# Altium project udemy_osman.PrjPcb (part 2 of 2)

## Sheet sensor board.SchDoc
size A3; SheetNumber: 5; SheetTotal: 5; department: R&D; Size: A3
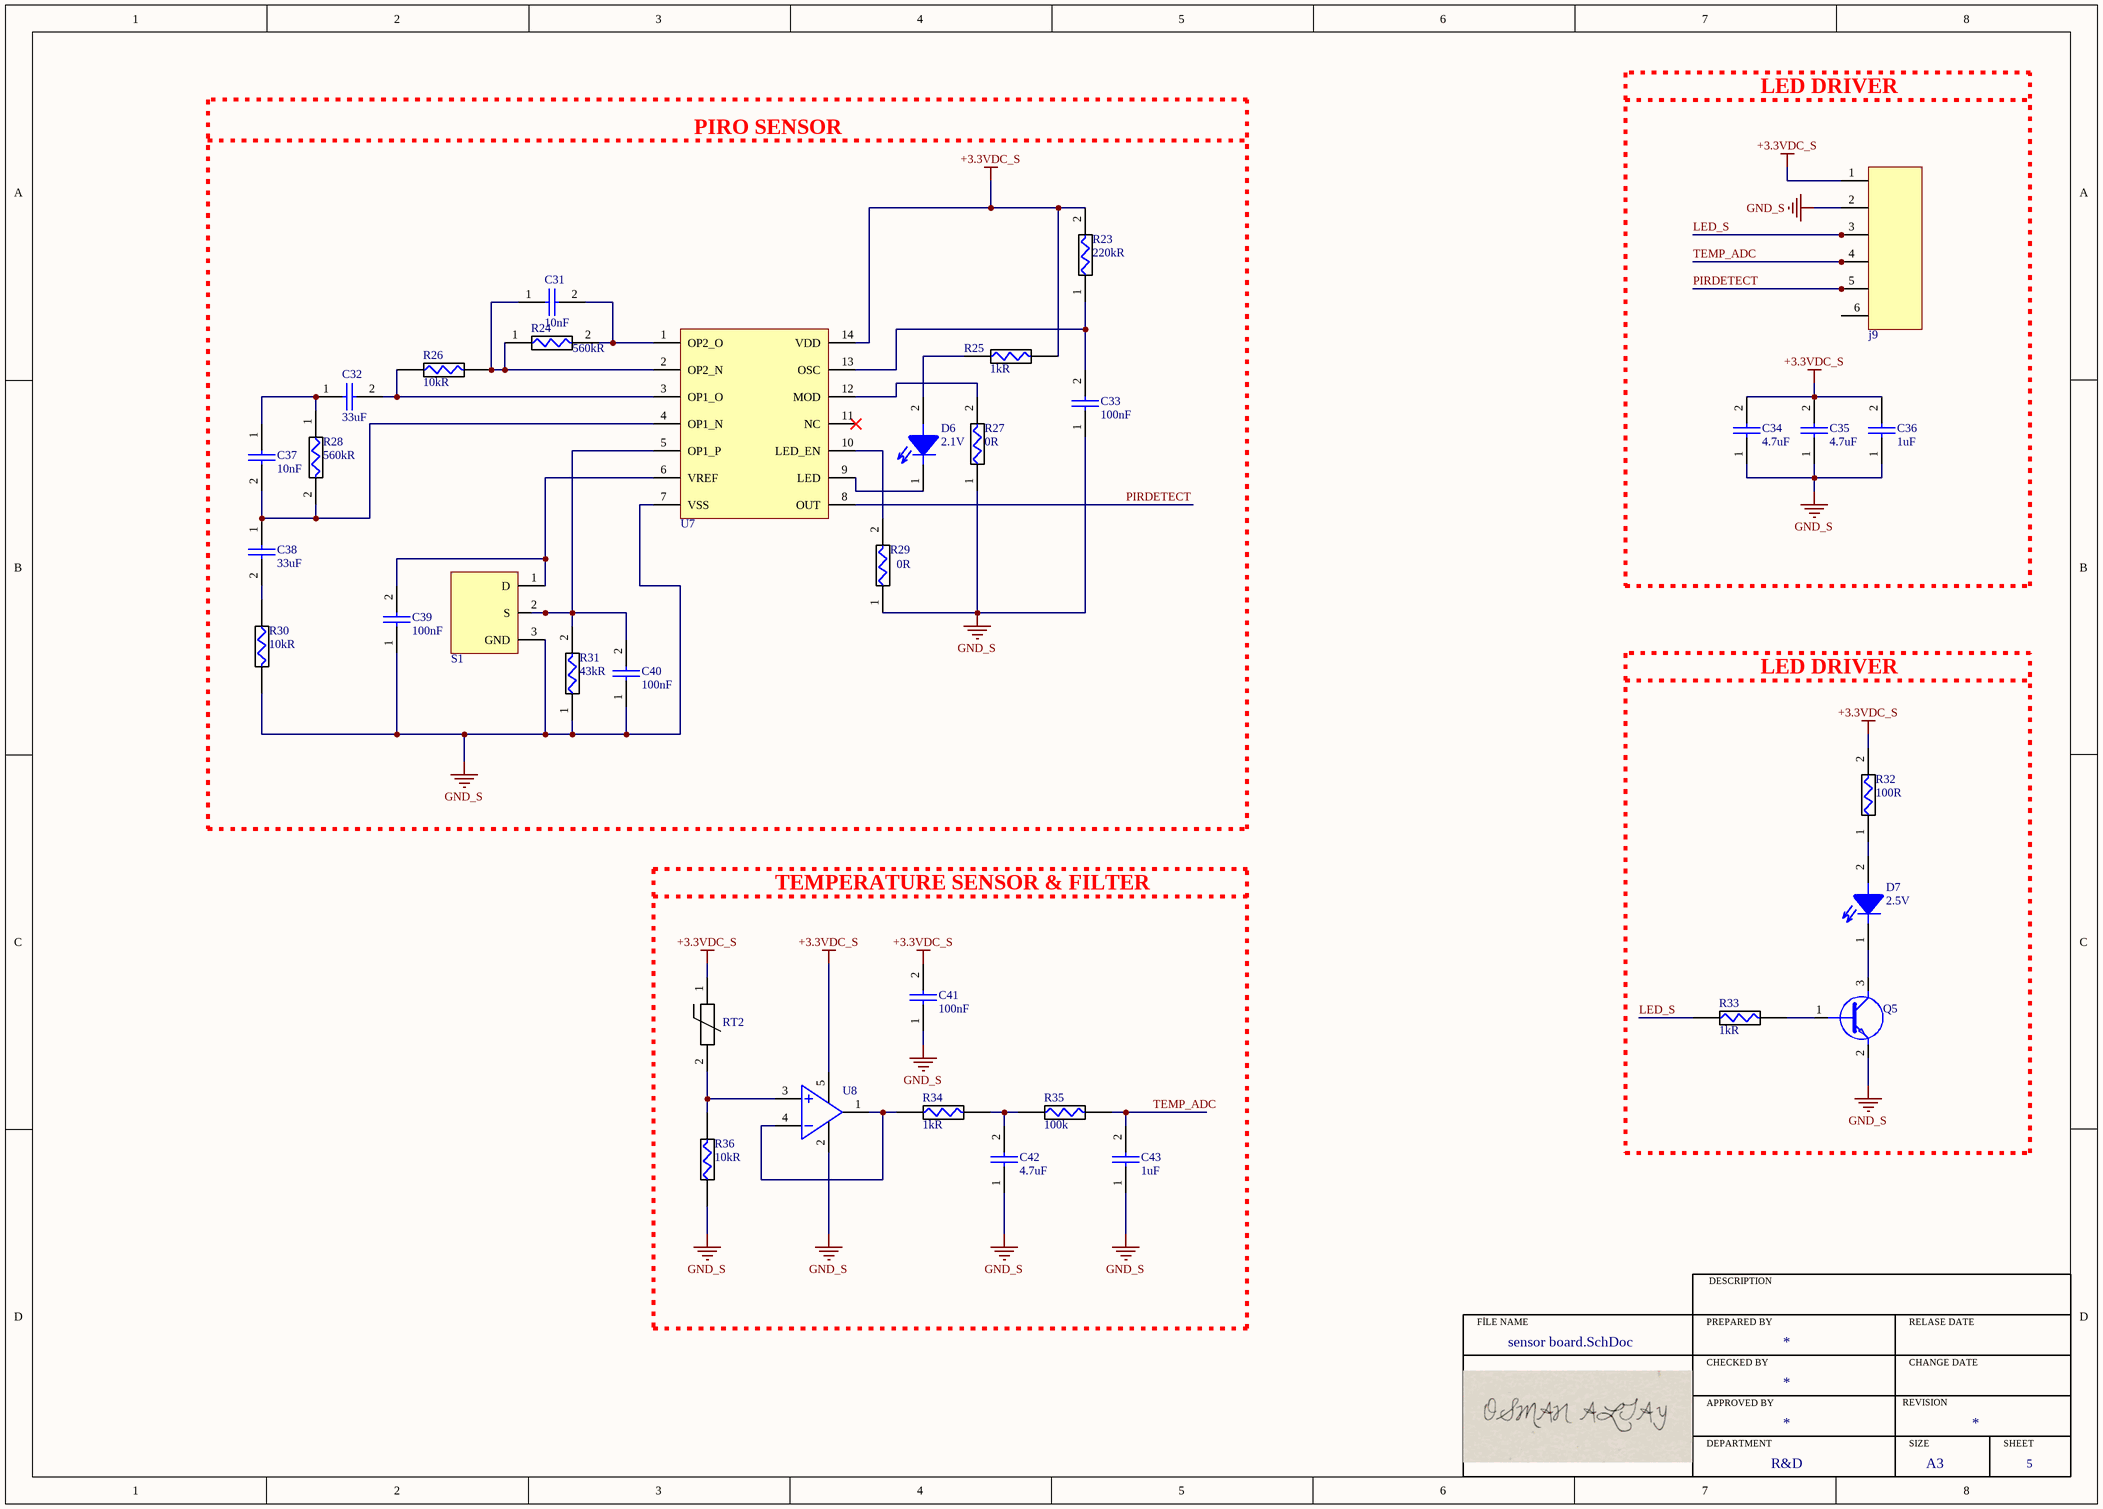
[diagram p2: sensor board.SchDoc]

### Parts
C31  value 10nF  [CAP_0603]  (hidden comment: 0603B103K160CT)
C32  value 33uF  [CAP_1206]  (hidden comment: C3216X5R1E336M160AC)
C33  value 100nF  [CAP_0603]  (hidden comment: C0603C104K1RACTU)
C34  value 4.7uF  [CAP_0805]  (hidden comment: CL21A475KAQNNNE)
C35  value 4.7uF  [CAP_0805]  (hidden comment: CL21A475KAQNNNE)
C36  value 1uF  [CAP_0805]  (hidden comment: CL21B105KBFNNNE)
C37  value 10nF  [CAP_0603]  (hidden comment: 0603B103K160CT)
C38  value 33uF  [CAP_1206]  (hidden comment: C3216X5R1E336M160AC)
C39  value 100nF  [CAP_0603]  (hidden comment: C0603C104K1RACTU)
C40  value 100nF  [CAP_0603]  (hidden comment: C0603C104K1RACTU)
C41  value 100nF  [CAP_0805]  (hidden comment: CL21B104KBCNNNC)
C42  value 4.7uF  [CAP_0805]  (hidden comment: CL21A475KAQNNNE)
C43  value 1uF  [CAP_0805]  (hidden comment: CL21B105KBFNNNE)
D6  foward voltage: 2.1V  [LED_GREEN_0805]  (hidden comment: CMD17-21VGD/TR8)
D7  Forward Voltage: 2.5V  [LED_RED_0805]  (hidden comment: LS R976-NR-1)
j9  64800611622  [64800611622_]  (value not drawn)
Q5  MMBT3904-7-F  [SOT23-3]  (value not drawn)
R23  value 220kR  [RES_0603]  (hidden comment: RC0201JR-07220KL)
R24  value 560kR  [RES_0603]  (hidden comment: RC0603JR-07560KL)
R25  value 1kR  [RES_0603]  (hidden comment: RC0201JR-071KL)
R26  value 10kR  [RES_0603]  (hidden comment: RC0603FR-0710KL)
R27  value 0R  [RES_0603]  (hidden comment: RC0603JR-070RL)
R28  value 560kR  [RES_0603]  (hidden comment: RC0603JR-07560KL)
R29  value 0R  [RES_0603]  (hidden comment: RC0603JR-070RL)
R30  value 10kR  [RES_0603]  (hidden comment: RC0603FR-0710KL)
R31  value 43kR  [RES_0603]  (hidden comment: RC0201JR-0743KL)
R32  value 100R  [RES_0603]  (hidden comment: RC0603FR-07100RL)
R33  value 1kR  [RES_0603]  (hidden comment: RC0201JR-071KL)
R34  value 1kR  [RES_0603]  (hidden comment: RC0201JR-071KL)
R35  value 100k  [RES_0603]  (hidden comment: SR0603FR-7T100KL)
R36  value 10kR  [RES_0603]  (hidden comment: RC0603FR-0710KL)
RT2  TFPT1206L1002FM  [TFPT1206]  (value not drawn)
S1  LHI 878/3902  [LHI 878]  (value not drawn)
U7  NCS36000DRG  [SOIC-14]  (value not drawn)
U8  OPA314AIDBVR  [SOT23-5]  (value not drawn)

### Blocks framed on the sheet
PIRO SENSOR: C31-C33 C37-C40 D6 R23-R31 S1 U7
LED DRIVER: C34-C36 j9
LED DRIVER: D7 Q5 R32 R33
TEMPERATURE SENSOR & FILTER: C41-C43 R34-R36 RT2 U8

### Nets
+3.3VDC_S: C34.2 C35.2 C36.2 C41.2 j9.1 R23.2 R25.2 R32.2 RT2.1 U7.14(VDD) U8.5(V+)
GND_S: C33.1 C34.1 C35.1 C36.1 C39.1 C40.1 C41.1 C42.1 C43.1 j9.2 Q5.2(E) R27.1 R29.1 R30.2 R31.1 R36.1 S1.3(GND) U7.7(VSS) U8.2(V-)
LED_S: j9.3 R33.1
PIRDETECT: j9.5 U7.8(OUT)
TEMP_ADC: C43.2 j9.4 R35.2
NetC31_1: C31.1 R24.1 R26.2 U7.2(OP2_N)
NetC31_2: C31.2 R24.2 U7.1(OP2_O)
NetC32_1: C32.1 C37.1 R28.1
NetC32_2: C32.2 R26.1 U7.3(OP1_O)
NetC33_2: C33.2 R23.1 U7.13(OSC)
NetC37_2: C37.2 C38.1 R28.2 U7.4(OP1_N)
NetC38_2: C38.2 R30.1
NetC39_2: C39.2 S1.1(D) U7.6(VREF)
NetC40_2: C40.2 R31.2 S1.2(S) U7.5(OP1_P)
NetC42_2: C42.2 R34.2 R35.1
NetD6_1: D6.1 U7.9(LED)
NetD6_2: D6.2 R25.1
NetD7_1: D7.1 Q5.3(C)
NetD7_2: D7.2 R32.1
NetQ5_1: Q5.1(B) R33.2
NetR27_2: R27.2 U7.12(MOD)
NetR29_2: R29.2 U7.10(LED_EN)
NetR34_1: R34.1 U8.1(OUT) U8.4(-IN)
NetR36_2: R36.2 RT2.2 U8.3(+IN)

Not connected (* = marked no-connect by the designer): j9 6; U7 11(NC)*

### Notes on the sheet
- FİLE NAME
- PREPARED BY
- DESCRIPTION
- RELASE DATE
- CHECKED BY
- APPROVED BY
- CHANGE DATE
- DEPARTMENT
- SIZE
- REVISION
- SHEET

### Library data of the parts
C31 C37 = CAP CER 10nF 0603: CAP CER 10nF %10 0603; Manufacturer: Walsin Technologies; Designed By: Osman; Supplier: Mouser; Supplier Part Number: 791-0603B103K160CT; Manufacturer Part Number: 0603B103K160CT; RoHS: Yes; Category: Ceramic Capacitors; Stock: 10639; Pricing: 1=0,1, 10=0,019, 50=0,019, 100=0,011, 1000=0,009, 10000=0,006 (USD); Lead Free: 5697LeadFree; ComponentLink1URL: http://www.farnell.com/datasheets/1958513.pdf?src-supplier=Farnell; ComponentLink1Description: http://www.farnell.com/datasheets/1958513.pdf?src-supplier=Farnell; ComponentLink2URL: http://www.passivecomponent.com/wp-content/uploads/2018/10/MLCC.pdf?src-supplier=Digi-Key; ComponentLink2Description: http://www.passivecomponent.com/wp-content/uploads/2018/10/MLCC.pdf?src-supplier=Digi-Key; ComponentLink3URL: https://datasheet.octopart.com/0603B103K160CT-Walsin-Technologies-datasheet-85392065.pdf?src-supplier=Element14; ComponentLink3Description: https://datasheet.octopart.com/0603B103K160CT-Walsin-Technologies-datasheet-85392065.pdf?src-supplier=Element14; ComponentLink4URL: https://datasheet.octopart.com/0603B103K160CT-Walsin-Technologies-datasheet-136037192.pdf?src-supplier=Future+Electronics; ComponentLink4Description: https://datasheet.octopart.com/0603B103K160CT-Walsin-Technologies-datasheet-136037192.pdf?src-supplier=Future+Electronics; ComponentLink5URL: https://datasheet.octopart.com/0603B103K160CT-Walsin-Technologies-datasheet-62066062.pdf?src-supplier=TME; ComponentLink5Description: https://datasheet.octopart.com/0603B103K160CT-Walsin-Technologies-datasheet-62066062.pdf?src-supplier=TME
C32 C38 = CAP CER 33uF 0603: Multilayer Ceramic Capacitor, 33 uF, 25 V, ± 20%, X5R, 1206 [3216 Metric]; Manufacturer: TDK; Material: 4241ConductorMaterial; ComponentLink1URL: https://datasheet.ciiva.com/24216/c3216x5r1e336m160ac-265051-24216512.pdf?src-supplier=Mouser; ComponentLink1Description: https://datasheet.ciiva.com/24216/c3216x5r1e336m160ac-265051-24216512.pdf?src-supplier=Mouser; ComponentLink2URL: https://datasheet.ciiva.com/6285/tdkmlcccaprange-6285278.pdf?src-supplier=Digi-Key; ComponentLink2Description: https://datasheet.ciiva.com/6285/tdkmlcccaprange-6285278.pdf?src-supplier=Digi-Key; Supplier: Digi-Key; Supplier Part Number: 445-8046-6-ND; Manufacturer Part Number: C3216X5R1E336M160AC; RoHS: Yes; Category: Ceramic Capacitors; Stock: 212727; Pricing: 1=0,93, 10=0,698, 50=0,637, 100=0,5218, 500=0,4165, 1000=0,3675 (USD)
C33 C39 C40 = CAP CER 100nf 0603: Capacitor, 0.1UF, 100V, MLCC, 0603;; Manufacturer: KEMET; Designed By: Osman; Supplier: Digi-Key; Supplier Part Number: 399-C0603C104K1RACTUCT-ND; Manufacturer Part Number: C0603C104K1RACTU; RoHS: No; Category: Ceramic Capacitors; Stock: 5862; Pricing: 1=0,27, 10=0,185, 50=0,1232, 100=0,1048, 500=0,07396, 1000=0,06471 (USD)
C34 C35 C42 = CAP CER 4.7uF 0805: CAP CER 4.7uF %10 0805; Manufacturer: Samsung; Material: Ceramic; Tolerance: 10%; Voltage Rating: 25V; Dielectric: X5R; Supplier Part Number: 187-CL21A475KAQNNNE; Manufacturer Part Number: CL21A475KAQNNNE; RoHS: Yes; Category: Ceramic Capacitors; Stock: 195468; Pricing: 1=0,1, 10=0,059, 50=0,059, 100=0,035, 1000=0,025, 10000=0,012 (USD); Mounting Technology: Surface Mount; Case/Package: 0805; Case Code (Metric): 2012; Case Code (Imperial): 0805; Min Operating Temperature: -55°C; Max Operating Temperature: 85°C; Packaging: Tape and Reel; Voltage Rating (DC): 25V; Series: CL; Construction: Flat; Length: 2mm; Height: 1.25mm; Depth: 1.25mm; Radiation Hardening: No; Lead Free: Lead Free; RoHS Compliant: Yes; ComponentLink1URL: https://datasheet.ciiva.com/25798/cl21a475kaqnnne-25798882.pdf?src-supplier=Digi-Key; ComponentLink1Description: https://datasheet.ciiva.com/25798/cl21a475kaqnnne-25798882.pdf?src-supplier=Digi-Key; Supplier: Mouser
C36 C43 = CAP CER 1uF 0805: CAP CER 1uF %10 0805; Manufacturer: Samsung; Material: Ceramic; Tolerance: 10%; Voltage Rating: 50V; Dielectric: X7R; Designed By: Osman; Supplier: Mouser; Supplier Part Number: 187-CL21B105KBFNNNE; Manufacturer Part Number: CL21B105KBFNNNE; RoHS: Yes; Category: Ceramic Capacitors; Stock: 126210; Pricing: 1=0,11, 10=0,045, 50=0,045, 100=0,027, 1000=0,026, 10000=0,015 (USD); Mounting Technology: Surface Mount; Case/Package: 0805; Case Code (Metric): 2012; Case Code (Imperial): 0805; Min Operating Temperature: -55°C; Max Operating Temperature: 125°C; Packaging: Tape and Reel; Package Quantity: 1; Voltage: 50V; Series: CL; Construction: Flat; Voltage Rating (DC): 50V; Length: 2mm; Width: 0.049inch; Height: 1.25mm; Thickness: 0.053inch; Depth: 1.25mm; Radiation Hardening: No; RoHS Compliant: Yes; ComponentLink1URL: https://datasheet.ciiva.com/25800/cl21b105kbfnnne-25800291.pdf?src-supplier=Digi-Key; ComponentLink1Description: https://datasheet.ciiva.com/25800/cl21b105kbfnnne-25800291.pdf?src-supplier=Digi-Key
C41 = CAP CER 100nF 0805: Manufacturer: Samsung; Material: Ceramic; Tolerance: 10%; Dielectric: X7R; Voltage Rating: 50V; Designed By: OSMAN; Supplier: Mouser; Supplier Part Number: 187-CL21B104KBCNNNC; Manufacturer Part Number: CL21B104KBCNNNC; RoHS: Yes; Category: Ceramic Capacitors; Stock: 995893; Pricing: 1=0,1, 10=0,024, 50=0,024, 100=0,014, 1000=0,012, 10000=0,008 (USD); Mounting Technology: Surface Mount; Case/Package: 0805; Case Code (Metric): 2012; Case Code (Imperial): 0805; Min Operating Temperature: -55°C; Max Operating Temperature: 125°C; Packaging: Tape and Reel; Voltage: 50V; Series: CL; Construction: Flat; Voltage Rating (DC): 50V; Length: 2mm; Width: 0.049inch; Height: 0.85mm; Depth: 1.25mm; Thickness: 0.037inch; Radiation Hardening: No; RoHS Compliant: Yes; Lead Free: 5697LeadFree; ComponentLink1URL: https://datasheet.ciiva.com/25710/cl21b104kbcnnnc-25710182.pdf?src-supplier=Digi-Key; ComponentLink1Description: https://datasheet.ciiva.com/25710/cl21b104kbcnnnc-25710182.pdf?src-supplier=Digi-Key; ComponentLink2URL: https://datasheet.ciiva.com/29199/454152-da-01-en-vs-kondensator-0805-29199814.pdf?src-supplier=Conrad; ComponentLink2Description: https://datasheet.ciiva.com/29199/454152-da-01-en-vs-kondensator-0805-29199814.pdf?src-supplier=Conrad
D6 = LED GREEN 0805: CML CMD17-21VGD/TR8 LED SMT 0805 2.1V 7mcd 140deg Green 3K Part of the VCC Family of Products; Manufacturer: VCC CHML; Supplier: Mouser; Supplier Part Number: 606-CMD17-21VGD; Manufacturer Part Number: CMD17-21VGD/TR8; RoHS: Yes; Category: LEDs; Stock: 23475; Pricing: 1=0,55, 10=0,358, 50=0,358, 100=0,257, 1000=0,208, 10000=0,189 (USD); ComponentLink1URL: https://datasheet.ciiva.com/46391/719069-46391062.pdf?src-supplier=Element14; ComponentLink1Description: https://datasheet.ciiva.com/46391/719069-46391062.pdf?src-supplier=Element14; ComponentLink2URL: https://datasheet.ciiva.com/16437/cmd17-21seriessmtleds0805packagesize-16437018.pdf?src-supplier=Future+Electronics; ComponentLink2Description: https://datasheet.ciiva.com/16437/cmd17-21seriessmtleds0805packagesize-16437018.pdf?src-supplier=Future+Electronics
D7 = LED RED 0805: LED Uni-Color Super Red 645nm 2-Pin Chip 0805(2012Metric) T/R; Manufacturer: Osram Opto; Designed By: Osman; Lens Color: White; Viewing Angle: 160°; Lens Style: Flat,Diffused,Colorless,Rectangular; Dominant Wavelength: 633nm; Luminous Flux: 0.47lm; Number of LEDs: 1; Forward Current: 25mA; Luminous Intensity: 180mcd; Test Current: 20mA; Power Dissipation: 65mW; Reverse Voltage: 12V; Lens Transparency: Diffused; Lens Size: 1.25mm; Supplier: Mouser; Supplier Part Number: 720-LSR976-NR-1; Manufacturer Part Number: LSR976-NR-1; RoHS: Yes; Category: LEDs; Stock: 694789; Pricing: 1=0,27, 10=0,147, 50=0,147, 100=0,063, 1000=0,05, 10000=0,038 (USD); Mounting Technology: Surface Mount; Case/Package: 0805; Pins: 2; Color: Red; Case Code (Metric): 2012; Case Code (Imperial): 0805; Min Operating Temperature: -30°C; Max Operating Temperature: 85°C; Packaging: Tape and Reel; Illumination Color: Red; Package Quantity: 16000; Number of Elements: 1; Series: CHIPLED 0805; Wavelength: 633nm; Length: 2.1mm; Width: 1.25mm; Height: 0.9mm; Depth: 1.35mm; Radiation Hardening: No; RoHS Compliant: Yes; ComponentLink1URL: https://datasheet.ciiva.com/4688/o-ls-ly-r976-24152-4688435.pdf?src-supplier=Mouser; ComponentLink1Description: https://datasheet.ciiva.com/4688/o-ls-ly-r976-24152-4688435.pdf?src-supplier=Mouser; ComponentLink2URL: https://datasheet.ciiva.com/26920/getdatasheetpartid-568367-26920831.pdf?src-supplier=Verical; ComponentLink2Description: https://datasheet.ciiva.com/26920/getdatasheetpartid-568367-26920831.pdf?src-supplier=Verical; ComponentLink3URL: https://datasheet.ciiva.com/2112/00078896-0-2112782.pdf?src-supplier=Digi-Key; ComponentLink3Description: https://datasheet.ciiva.com/2112/00078896-0-2112782.pdf?src-supplier=Digi-Key; ComponentLink4URL: https://datasheet.ciiva.com/2112/00078896-0-2112781.pdf?src-supplier=Digi-Key; ComponentLink4Description: https://datasheet.ciiva.com/2112/00078896-0-2112781.pdf?src-supplier=Digi-Key; ComponentLink5URL: https://datasheet.ciiva.com/2112/00078896-0-2112783.pdf?src-supplier=Digi-Key; ComponentLink5Description: https://datasheet.ciiva.com/2112/00078896-0-2112783.pdf?src-supplier=Digi-Key
j9 = 64800611622_conn_6pin: WR-WTB Wire-to-Board Connectors 1.50 mm; Manufacturer: Wurth Electronics; Supplier: Farnell; Supplier Part Number: 3818179; Manufacturer Part Number: 64800611622; RoHS: No; Category: Uncategorized; Stock: 8; Pricing: 10=0,407, 100=0,343, 500=0,307, 1000=0,284, 2500=0,275, 5000=0,257 (EUR)
Q5 = MMBT3904-7-F: Transistor General Purpose BJT NPN 40 Volt 0.2A Automotive 3-Pin SOT-23; Manufacturer: Diodes Zetex; Designed By: Osman; Max Power Dissipation: 300mW; Collector Emitter Voltage (VCEO): 40V; Max Collector Current: 200mA; Collector Base Voltage (VCBO): 60V; Power Dissipation: 350mW; Frequency: 300MHz; hFE Min: 100; Number of Elements: 1; Emitter Base Voltage (VEBO): 6V; Collector Emitter Saturation Voltage: 300mV; Supplier: Mouser; Supplier Part Number: 621-MMBT3904-F; Manufacturer Part Number: MMBT3904-7-F; RoHS: Yes; Category: BJTs; Stock: 3104650; Pricing: 1=0,11, 10=0,076, 50=0,076, 100=0,048, 1000=0,021, 10000=0,014 (USD); Mounting Technology: Surface Mount; Case/Package: SOT-23; Pins: 3; Weight: 0.000282oz; Min Operating Temperature: -55°C; Max Operating Temperature: 150°C; Polarity: NPN; Packaging: Tape and Reel; Package Quantity: 3000; Transition Frequency: 300MHz; Collector Emitter Breakdown Voltage: 40V; Max Breakdown Voltage: 40V; Continuous Collector Current: 200mA; Clock Frequency: 300MHz; Gain Bandwidth Product: 300MHz; Voltage Rating (DC): 40V; Series: Automotive, AEC-Q101; Collector-emitter Voltage-Max: 300mV; Length: 3.05mm; Width: 1.4mm; Height: 1mm; Radiation Hardening: No; Reach SVHC Compliant: No; Lead Free: Lead Free; RoHS Compliant: Yes; ComponentLink1URL: https://datasheet.ciiva.com/11201/ds30036-11201778.pdf?src-supplier=Avnet; ComponentLink1Description: https://datasheet.ciiva.com/11201/ds30036-11201778.pdf?src-supplier=Avnet; ComponentLink2URL: https://datasheet.ciiva.com/15138/getdatasheetpartid-53265-15138780.pdf?src-supplier=Verical; ComponentLink2Description: https://datasheet.ciiva.com/15138/getdatasheetpartid-53265-15138780.pdf?src-supplier=Verical; ComponentLink3URL: https://datasheet.ciiva.com/22711/1915516-22711750.pdf?src-supplier=Element14; ComponentLink3Description: https://datasheet.ciiva.com/22711/1915516-22711750.pdf?src-supplier=Element14; ComponentLink4URL: https://datasheet.ciiva.com/11198/ds30036-11198999.pdf?src-supplier=Avnet; ComponentLink4Description: https://datasheet.ciiva.com/11198/ds30036-11198999.pdf?src-supplier=Avnet; ComponentLink5URL: https://datasheet.ciiva.com/6361/ds30036-6361256.pdf?src-supplier=Digi-Key; ComponentLink5Description: https://datasheet.ciiva.com/6361/ds30036-6361256.pdf?src-supplier=Digi-Key; ComponentLink6URL: https://datasheet.ciiva.com/6361/ds30036-6361254.pdf?src-supplier=Digi-Key; ComponentLink6Description: https://datasheet.ciiva.com/6361/ds30036-6361254.pdf?src-supplier=Digi-Key
R23 = RES 220K OHM 0603: SMD Chip Resistor, 220 kOhm, ± 5%, 50 mW, 0201 [0603 Metric], Thick Film, General Purpose; Manufacturer: Yageo; Voltage Rating (DC): 25V; Supplier: Digi-Key; Supplier Part Number: 311-220KNTR-ND; Manufacturer Part Number: RC0201JR-07220KL; RoHS: Yes; Category: Chip SMD Resistors; Stock: 10000; Pricing: 10000=0,00414, 20000=0,0037, 30000=0,00347, 50000=0,00322, 100000=0,00293 (USD); ComponentLink1URL: https://datasheet.ciiva.com/2522/pyu-r-int-thick-7-2522686.pdf?src-supplier=Digi-Key; ComponentLink1Description: https://datasheet.ciiva.com/2522/pyu-r-int-thick-7-2522686.pdf?src-supplier=Digi-Key; ComponentLink2URL: https://datasheet.ciiva.com/2522/pyu-r-int-thick-7-2522687.pdf?src-supplier=Digi-Key; ComponentLink2Description: https://datasheet.ciiva.com/2522/pyu-r-int-thick-7-2522687.pdf?src-supplier=Digi-Key; ComponentLink3URL: https://datasheet.ciiva.com/2522/pyu-r-int-thick-7-2522688.pdf?src-supplier=Digi-Key; ComponentLink3Description: https://datasheet.ciiva.com/2522/pyu-r-int-thick-7-2522688.pdf?src-supplier=Digi-Key; ComponentLink4URL: https://datasheet.ciiva.com/5924/1563626-5924922.pdf?src-supplier=Farnell; ComponentLink4Description: https://datasheet.ciiva.com/5924/1563626-5924922.pdf?src-supplier=Farnell; ComponentLink5URL: https://datasheet.ciiva.com/8886/pyu-rc0201-51-rohs-l-8-8886799.pdf?src-supplier=Avnet; ComponentLink5Description: https://datasheet.ciiva.com/8886/pyu-rc0201-51-rohs-l-8-8886799.pdf?src-supplier=Avnet; ComponentLink6URL: https://datasheet.ciiva.com/7672/1563626-7672268.pdf?src-supplier=Element14; ComponentLink6Description: https://datasheet.ciiva.com/7672/1563626-7672268.pdf?src-supplier=Element14; ComponentLink7URL: https://datasheet.ciiva.com/7672/1563626-7672269.pdf?src-supplier=Element14; ComponentLink7Description: https://datasheet.ciiva.com/7672/1563626-7672269.pdf?src-supplier=Element14
R24 R28 = RES 560K OHM 0603: SMD Chip Resistor, 560 kOhm, ± 5%, 100 mW, 0603 [1608 Metric], Thick Film, General Purpose; Manufacturer: Yageo; Designed By: OSMAN; Power Rating: 100mW; Voltage Rating: 75V; Voltage Rating (DC): 50V; Temperature Coefficient: 100ppm/°C; Supplier: Farnell; Supplier Part Number: 4151651; Manufacturer Part Number: RC0603JR-07560KL; RoHS: Yes; Category: Chip SMD Resistors; Stock: 5000; Pricing: 5000=0,003, 25000=0,0025, 50000=0,002 (EUR); Case/Package: 0603; Pins: 2; Case Code (Metric): 1608; Case Code (Imperial): 0603; Weight: 7.1E-05oz; Min Operating Temperature: -55°C; Max Operating Temperature: 155°C; Package Quantity: 1; Tolerance: 5%; Packaging: Tape and Reel; Resistor Type: Thick Film; Number of Terminations: 2; Termination: SMD/SMT; Max Power Dissipation: 100mW; Working Voltage: 75V; Features: Moisture Resistant; Series: RC; Resistance Tolerance: 5%; Technology: THICK FILM; Voltage Rating (AC): 50V; Length: 0.063inch; Width: 0.8mm; Height: 0.022inch; Lead Free: Lead Free; RoHS Compliant: Yes; Reach SVHC Compliant: Unknown; ComponentLink1URL: https://datasheet.ciiva.com/2453/pyu-r-int-thick-7-2453056.pdf?src-supplier=Digi-Key; ComponentLink1Description: https://datasheet.ciiva.com/2453/pyu-r-int-thick-7-2453056.pdf?src-supplier=Digi-Key; ComponentLink2URL: https://datasheet.ciiva.com/2453/pyu-r-int-thick-7-2453057.pdf?src-supplier=Digi-Key; ComponentLink2Description: https://datasheet.ciiva.com/2453/pyu-r-int-thick-7-2453057.pdf?src-supplier=Digi-Key; ComponentLink3URL: https://datasheet.ciiva.com/2453/pyu-r-int-thick-7-2453055.pdf?src-supplier=Digi-Key; ComponentLink3Description: https://datasheet.ciiva.com/2453/pyu-r-int-thick-7-2453055.pdf?src-supplier=Digi-Key
R25 R33 R34 = RES 1K OHM 0603: Res Thick Film 0201 1K Ohm 5% 0.05W(1/20W) ±200ppm/C Pad SMD T/R; Manufacturer: Yageo; Supplier: Digi-Key; Supplier Part Number: 311-1KNCT-ND; Manufacturer Part Number: RC0201JR-071KL; RoHS: Yes; Category: Chip SMD Resistors; Stock: 16512; Pricing: 1=0,1, 10=0,02, 50=0,0124, 100=0,0104, 500=0,0071, 1000=0,00612, 5000=0,00444 (USD); ComponentLink1URL: https://datasheet.ciiva.com/46391/1421516-46391293.pdf?src-supplier=Element14; ComponentLink1Description: https://datasheet.ciiva.com/46391/1421516-46391293.pdf?src-supplier=Element14; ComponentLink2URL: https://datasheet.ciiva.com/7660/1421516-7660811.pdf?src-supplier=Element14; ComponentLink2Description: https://datasheet.ciiva.com/7660/1421516-7660811.pdf?src-supplier=Element14; ComponentLink3URL: https://datasheet.ciiva.com/7672/1563626-7672264.pdf?src-supplier=Element14; ComponentLink3Description: https://datasheet.ciiva.com/7672/1563626-7672264.pdf?src-supplier=Element14; ComponentLink4URL: https://datasheet.ciiva.com/7672/1563626-7672265.pdf?src-supplier=Element14; ComponentLink4Description: https://datasheet.ciiva.com/7672/1563626-7672265.pdf?src-supplier=Element14; ComponentLink5URL: https://datasheet.ciiva.com/8896/pyu-rc0201-51-rohs-l-8-8896175.pdf?src-supplier=Avnet; ComponentLink5Description: https://datasheet.ciiva.com/8896/pyu-rc0201-51-rohs-l-8-8896175.pdf?src-supplier=Avnet; ComponentLink6URL: https://datasheet.ciiva.com/2462/pyu-r-int-thick-7-2462829.pdf?src-supplier=Digi-Key; ComponentLink6Description: https://datasheet.ciiva.com/2462/pyu-r-int-thick-7-2462829.pdf?src-supplier=Digi-Key; ComponentLink7URL: https://datasheet.ciiva.com/2462/pyu-r-int-thick-7-2462830.pdf?src-supplier=Digi-Key; ComponentLink7Description: https://datasheet.ciiva.com/2462/pyu-r-int-thick-7-2462830.pdf?src-supplier=Digi-Key; ComponentLink8URL: https://datasheet.ciiva.com/2462/pyu-r-int-thick-7-2462831.pdf?src-supplier=Digi-Key; ComponentLink8Description: https://datasheet.ciiva.com/2462/pyu-r-int-thick-7-2462831.pdf?src-supplier=Digi-Key
R26 R30 R36 = RES 10K Ohm 0603: RES 10K OHM %10 0603; Manufacturer: Yageo; Tolerance: 1%; Temperature Coefficient: 100ppm/°C; Voltage Rating (DC): 50V; Power Rating: 100mW; Voltage Rating: 75V; Designed Ny: Osman; Supplier: Digi-Key; Supplier Part Number: 311-10.0KHRDKR-ND; Manufacturer Part Number: RC0603FR-0710KL; RoHS: Yes; Category: Chip SMD Resistors; Stock: 22481256; Pricing: 1=0,1, 10=0,018, 50=0,0106, 100=0,0088, 500=0,00592, 1000=0,00505 (USD); Case/Package: 0603; Pins: 2; Case Code (Imperial): 0603; Case Code (Metric): 1608; Weight: 7.1E-05oz; Min Operating Temperature: -55°C; Max Operating Temperature: 155°C; Resistor Type: Thick Film; Packaging: Tape and Reel; Termination: SMD/SMT; Features: Moisture Resistant; Series: RC; Max Power Dissipation: 100mW; Number of Terminations: 2; Resistance Tolerance: 1%; Construction: Rectangular; Length: 1.6mm; Width: 0.8mm; Height: 0.45mm; Depth: 0.8mm; Lead Pitch: 0.3mm; Reach SVHC Compliant: No; Lead Free: 5697LeadFree; Military Standard: Not; RoHS Compliant: Yes; ComponentLink1URL: https://datasheet.ciiva.com/7660/38590-7660789.pdf?src-supplier=Element14; ComponentLink1Description: https://datasheet.ciiva.com/7660/38590-7660789.pdf?src-supplier=Element14; ComponentLink2URL: https://datasheet.ciiva.com/7983/443971-7983596.pdf?src-supplier=Element14; ComponentLink2Description: https://datasheet.ciiva.com/7983/443971-7983596.pdf?src-supplier=Element14; ComponentLink3URL: https://datasheet.ciiva.com/22747/443971-22747519.pdf?src-supplier=Element14; ComponentLink3Description: https://datasheet.ciiva.com/22747/443971-22747519.pdf?src-supplier=Element14; ComponentLink4URL: https://datasheet.ciiva.com/46440/1868787-46440891.pdf?src-supplier=Element14; ComponentLink4Description: https://datasheet.ciiva.com/46440/1868787-46440891.pdf?src-supplier=Element14; ComponentLink5URL: https://datasheet.ciiva.com/7746/1738695-7746239.pdf?src-supplier=Element14; ComponentLink5Description: https://datasheet.ciiva.com/7746/1738695-7746239.pdf?src-supplier=Element14; ComponentLink6URL: https://datasheet.ciiva.com/15189/getdatasheetpartid-409289-15189591.pdf?src-supplier=Verical; ComponentLink6Description: https://datasheet.ciiva.com/15189/getdatasheetpartid-409289-15189591.pdf?src-supplier=Verical
R27 R29 = RES 0 OHM 603: Zero Ohm Resistor, Jumper, 0603 [1608 Metric], Thick Film, 100 mW, 1 A, Surface Mount; Manufacturer: Yageo; Tolerance: 1%; Power Rating: 100mW; Voltage Rating (DC): 50V; Temperature Coefficient: 200ppm/°C; Resistance Tolerance: 5%; Designed By: Osman; Supplier: Mouser; Supplier Part Number: 603-RC0603JR-070RL; Manufacturer Part Number: RC0603JR-070RL; RoHS: Yes; Category: Chip SMD Resistors; Stock: 3058664; Pricing: 1=0,1, 10=0,009, 50=0,009, 100=0,004, 1000=0,003, 10000=0,002 (USD); Case/Package: 0603; Pins: 2; Contact Plating: Tin,Matte; Case Code (Imperial): 0603; Case Code (Metric): 1608; Min Operating Temperature: -55°C; Max Operating Temperature: 155°C; Resistor Type: Thick Film; Packaging: Tape and Reel; Termination: SMD/SMT; Series: RC; Technology: THICK FILM; Package Quantity: 5000; Voltage Rating: 50V; Features: Moisture Resistant; Max Power Dissipation: 100mW; Number of Terminations: 2; Construction: Rectangular; Length: 1.6mm; Width: 0.8mm; Height: 0.45mm; Depth: 0.8mm; RoHS Compliant: Yes; Reach SVHC Compliant: Unknown; Lead Free: 5697LeadFree; Military Standard: Not; ComponentLink1URL: https://datasheet.ciiva.com/11808/pyu-r-int-6-11808700.pdf?src-supplier=Rs; ComponentLink1Description: https://datasheet.ciiva.com/11808/pyu-r-int-6-11808700.pdf?src-supplier=Rs; ComponentLink2URL: https://datasheet.ciiva.com/22747/443971-22747530.pdf?src-supplier=Element14; ComponentLink2Description: https://datasheet.ciiva.com/22747/443971-22747530.pdf?src-supplier=Element14; ComponentLink3URL: https://datasheet.ciiva.com/12555/rc0603-272842-12555254.pdf?src-supplier=Mouser; ComponentLink3Description: https://datasheet.ciiva.com/12555/rc0603-272842-12555254.pdf?src-supplier=Mouser; ComponentLink4URL: https://datasheet.ciiva.com/7746/1738695-7746421.pdf?src-supplier=Element14; ComponentLink4Description: https://datasheet.ciiva.com/7746/1738695-7746421.pdf?src-supplier=Element14; ComponentLink5URL: https://datasheet.ciiva.com/7746/1738695-7746422.pdf?src-supplier=Element14; ComponentLink5Description: https://datasheet.ciiva.com/7746/1738695-7746422.pdf?src-supplier=Element14; ComponentLink6URL: https://datasheet.ciiva.com/8883/pyu-rc0603-51-rohs-l-4-8883045.pdf?src-supplier=Avnet; ComponentLink6Description: https://datasheet.ciiva.com/8883/pyu-rc0603-51-rohs-l-4-8883045.pdf?src-supplier=Avnet; ComponentLink7URL: https://datasheet.ciiva.com/15189/getdatasheetpartid-329462-15189845.pdf?src-supplier=Verical; ComponentLink7Description: https://datasheet.ciiva.com/15189/getdatasheetpartid-329462-15189845.pdf?src-supplier=Verical
R31 = RES 43K OHM 0603: Res Thick Film 0201 43K Ohm 5% 0.05W(1/20W) ±200ppm/C Pad SMD T/R; Manufacturer: Yageo; Max Power Dissipation: 50mW; Temperature Coefficient: 200ppm/°C; Supplier: Digi-Key; Supplier Part Number: YAG2901TR-ND; Manufacturer Part Number: RC0201JR-0743KL; RoHS: Yes; Category: Chip SMD Resistors; Stock: 10000; Pricing: 10000=0,00394, 20000=0,00351, 30000=0,00329, 50000=0,00306, 100000=0,00279 (USD); Case/Package: 0201; Case Code (Metric): 0603; Case Code (Imperial): 0201; Min Operating Temperature: -55°C; Max Operating Temperature: 125°C; Packaging: Cut Tape; Number of Terminations: 2; Tolerance: 5%; Features: Moisture Resistant; Series: RC; Length: 0.024inch; Width: 0.012inch; Height: 0.01inch; RoHS Compliant: Yes; ComponentLink1URL: http://www.yageo.com.tw/exep/pages/download/literatures/PYu-R_INT-thick_7.pdf?src-supplier=Digi-Key; ComponentLink1Description: http://www.yageo.com.tw/exep/pages/download/literatures/PYu-R_INT-thick_7.pdf?src-supplier=Digi-Key; ComponentLink2URL: https://www.yageo.com/upload/media/product/productsearch/datasheet/rchip/PYu-RC_Group_51_RoHS_L_11.pdf?src-supplier=Digi-Key; ComponentLink2Description: https://www.yageo.com/upload/media/product/productsearch/datasheet/rchip/PYu-RC_Group_51_RoHS_L_11.pdf?src-supplier=Digi-Key
R32 = RES 100 OHM 0603: SMD Chip Resistor, 100 Ohm, ± 1%, 100 mW, 0603 [1608 Metric], Thick Film, General Purpose; Manufacturer: Yageo; Temperature Coefficient: 100ppm/°C; Voltage Rating (DC): 50V; Power Rating: 100mW; Supplier: Digi-Key; Supplier Part Number: 311-100HRTR-ND; Manufacturer Part Number: RC0603FR-07100RL; RoHS: Yes; Category: Chip SMD Resistors; Stock: 2448697; Pricing: 5000=0,00382, 10000=0,00335, 25000=0,00287, 35000=0,00278, 50000=0,00257, 125000=0,00232 (USD); Case/Package: 0603; Pins: 2; Case Code (Imperial): 0603; Case Code (Metric): 1608; Min Operating Temperature: -55°C; Max Operating Temperature: 155°C; Tolerance: 1%; Resistor Type: Thick Film; Packaging: Tape and Reel; Voltage Rating: 50V; Termination: SMD/SMT; Features: Moisture Resistant; Series: RC; Max Power Dissipation: 100mW; Number of Terminations: 2; Construction: Rectangular; Resistance Tolerance: 1%; Technology: THICK FILM; Length: 1.6mm; Width: 0.8mm; Height: 0.45mm; Depth: 0.8mm; Lead Free: Lead Free; RoHS Compliant: Yes; Reach SVHC Compliant: Unknown; Military Standard: Not
R35 = RES 100K OHM 0603: Res Thick Film 0603 100K Ohm 1% 0.25W(1/4W) ±100ppm/°C Pad SMD T/R Automotive AEC-Q200; Manufacturer: Yageo; Power Rating: 250mW; Voltage Rating: 75V; Supplier: Digikey; Supplier Part Number: YAG5821CT-ND; Manufacturer Part Number: SR0603FR-7T100KL; RoHS: Yes; Category: Chip SMD Resistors; Stock: 6501; Pricing: 1=0,88, 10=0,504, 50=0,3618, 100=0,3174, 500=0,24332, 1000=0,21985 (USD); Height: 550um; ComponentLink1URL: https://datasheet.octopart.com/SR0603FR-7T100KL-Yageo-datasheet-155675517.pdf?src-supplier=Future+Electronics; ComponentLink1Description: https://datasheet.octopart.com/SR0603FR-7T100KL-Yageo-datasheet-155675517.pdf?src-supplier=Future+Electronics; ComponentLink2URL: http://www.yageo.com/documents/recent/PYu-SR_D_F%20tol_RoHS_L_3.pdf?src-supplier=Digikey; ComponentLink2Description: http://www.yageo.com/documents/recent/PYu-SR_D_F%20tol_RoHS_L_3.pdf?src-supplier=Digikey; ComponentLink3URL: https://www.yageo.com/upload/media/product/productsearch/datasheet/rchip/PYu-SR_D_F%20tol_RoHS_L_4.pdf?src-supplier=Digikey; ComponentLink3Description: https://www.yageo.com/upload/media/product/productsearch/datasheet/rchip/PYu-SR_D_F%20tol_RoHS_L_4.pdf?src-supplier=Digikey
RT2 = TFPT1206L1002FM: Thermistor PTC 10K Ohm 1% 2-Pin 1206 Surface Mount Solder Pad T/R Automotive; Manufacturer: Vishay Dale; Value: 10kR; Power Rating: 125mW; Voltage: 40V; Designed By: Osman; Supplier: Mouser; Supplier Part Number: 71-TFPT1206L1002FM; Manufacturer Part Number: TFPT1206L1002FM; RoHS: Yes; Category: Thermistors; Stock: 1411; Pricing: 1=1,3, 10=0,727, 50=0,727, 100=0,671, 1000=0,546, 10000=0,445 (USD); Mounting Technology: Surface Mount; Case/Package: 1206; Case Code (Imperial): 1206; Min Operating Temperature: -55°C; Max Operating Temperature: 125°C; Packaging: Tape and Reel; Package Quantity: 5000; Tolerance: 1%; Max Power Dissipation: 125mW; Termination: SMD/SMT; Series: TFPT; Resistance Tolerance: 1%; Length: 3.2mm; Width: 1.6mm; Height: 0.55mm; Lead Free: Lead Free; RoHS Compliant: Yes; ComponentLink1URL: https://datasheet.ciiva.com/2852/tfpt-2852076.pdf?src-supplier=Digi-Key; ComponentLink1Description: https://datasheet.ciiva.com/2852/tfpt-2852076.pdf?src-supplier=Digi-Key
S1 = LHI 878/3902: SENSOR PYRO DETECTOR DUAL MOTION; Designey By: Osman Altay; Min Supply Voltage: 2; Max Supply Voltage: 12; type: Pyro Detector; Supplier Part Number: 1601-LHI878/3902-ND; Supplier 1: Digi-key
U7 = NCS36000DRG: NCS36000 Series Single 5.75V Passive Infrared Detector Controller (PIR) -SOIC-14; Manufacturer: ON Semiconductor; Designed By: Osman; Supplier: Mouser; Supplier Part Number: 863-NCS36000DRG; Manufacturer Part Number: NCS36000DRG; RoHS: Yes; Category: Amplifiers - Op Amps, Buffer, Instrumentation; Stock: 14064; Pricing: 1=1,19, 10=1,02, 50=1,02, 100=0,687, 1000=0,507, 10000=0,448 (USD); ComponentLink1URL: https://datasheet.ciiva.com/4763/ncs36000-d-89569-4763639.pdf?src-supplier=Mouser; ComponentLink1Description: https://datasheet.ciiva.com/4763/ncs36000-d-89569-4763639.pdf?src-supplier=Mouser; ComponentLink2URL: https://datasheet.ciiva.com/1781/ncs36000-d-1781637.pdf?src-supplier=Digi-Key; ComponentLink2Description: https://datasheet.ciiva.com/1781/ncs36000-d-1781637.pdf?src-supplier=Digi-Key; ComponentLink3URL: https://datasheet.ciiva.com/2965/ncs36000-d-2965212.pdf?src-supplier=Avnet; ComponentLink3Description: https://datasheet.ciiva.com/2965/ncs36000-d-2965212.pdf?src-supplier=Avnet; ComponentLink4URL: https://datasheet.ciiva.com/2966/ncs36000-d-2966525.pdf?src-supplier=Avnet; ComponentLink4Description: https://datasheet.ciiva.com/2966/ncs36000-d-2966525.pdf?src-supplier=Avnet; ComponentLink5URL: https://datasheet.ciiva.com/1781/ncs36000-d-1781638.pdf?src-supplier=Digi-Key; ComponentLink5Description: https://datasheet.ciiva.com/1781/ncs36000-d-1781638.pdf?src-supplier=Digi-Key; ComponentLink6URL: https://datasheet.ciiva.com/1781/ncs36000-d-1781639.pdf?src-supplier=Digi-Key; ComponentLink6Description: https://datasheet.ciiva.com/1781/ncs36000-d-1781639.pdf?src-supplier=Digi-Key
U8 = OPA314: IC OPAMP GP 3MHZ RRO SOT23-5; Manufacturer: Texas Instruments; Designed By: Osman; Supplier: Mouser; Supplier Part Number: 595-OPA314AIDBVR; Manufacturer Part Number: OPA314AIDBVR; RoHS: Yes; Category: Amplifiers - Op Amps, Buffer, Instrumentation; Stock: 12247; Pricing: 1=1,16, 10=0,982, 50=0,982, 100=0,754, 1000=0,526, 10000=0,458 (USD); ComponentLink1URL: https://datasheet.ciiva.com/14456/opa2314-14456281.pdf?src-supplier=Avnet; ComponentLink1Description: https://datasheet.ciiva.com/14456/opa2314-14456281.pdf?src-supplier=Avnet; ComponentLink2URL: https://datasheet.ciiva.com/14462/opa2314-14462006.pdf?src-supplier=Avnet; ComponentLink2Description: https://datasheet.ciiva.com/14462/opa2314-14462006.pdf?src-supplier=Avnet; ComponentLink3URL: https://datasheet.ciiva.com/29638/opa314-29638827.pdf?src-supplier=Digi-Key; ComponentLink3Description: https://datasheet.ciiva.com/29638/opa314-29638827.pdf?src-supplier=Digi-Key